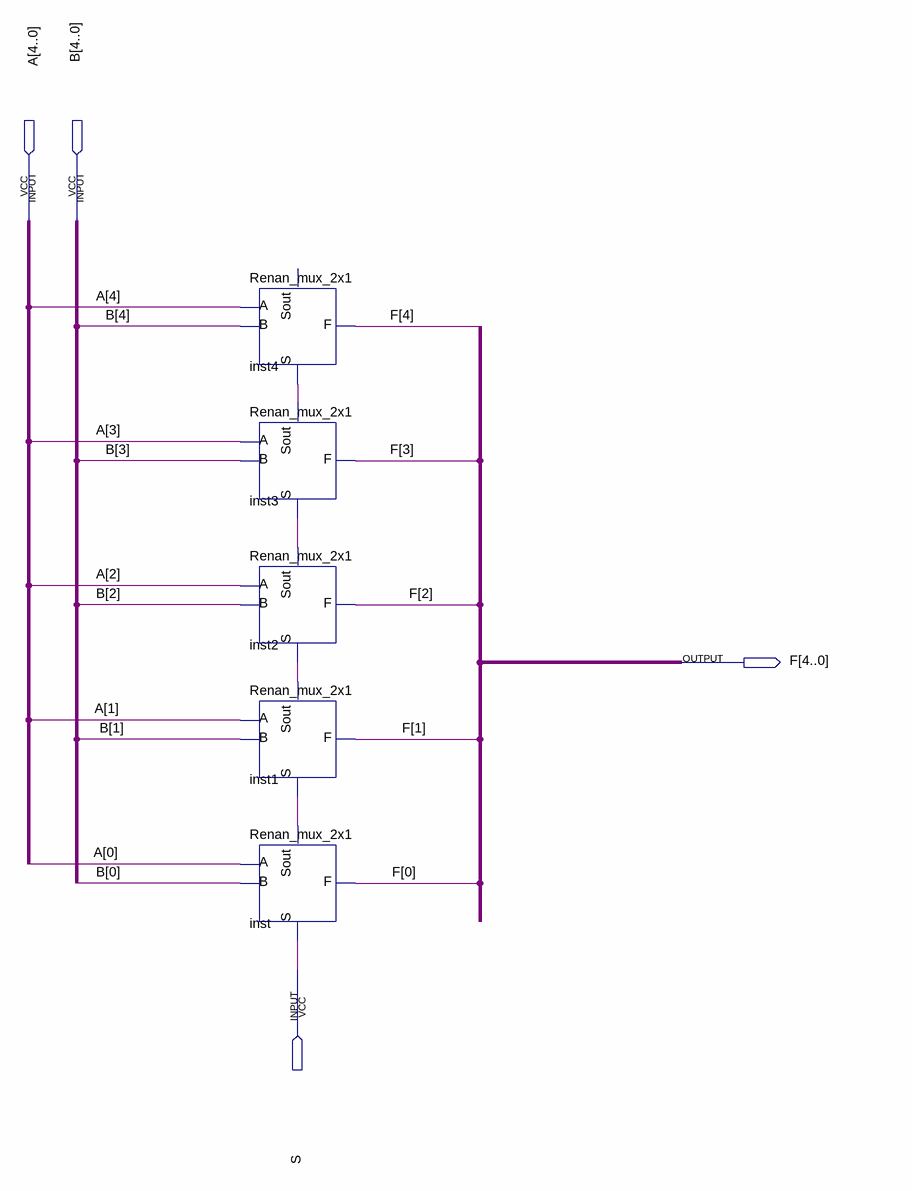
[diagram p0: schematic sheet]
// Quartus schematic mhrs_renan_2x1_total.bdf as structural Verilog: 5 symbols, 4 pins
module mhrs_renan_2x1_total (
  input  [4:0] A,
  input  [4:0] B,
  input  S,
  output [4:0] F
);

  wire inst1_sout, inst2_sout, inst3_sout, inst_sout;

  Renan_mux_2x1 inst4 (.A(A[4]), .B(B[4]), .S(inst3_sout), .F(F[4]));  // open: Sout
  Renan_mux_2x1 inst3 (.A(A[3]), .B(B[3]), .S(inst2_sout), .Sout(inst3_sout), .F(F[3]));
  Renan_mux_2x1 inst2 (.A(A[2]), .B(B[2]), .S(inst1_sout), .Sout(inst2_sout), .F(F[2]));
  Renan_mux_2x1 inst1 (.A(A[1]), .B(B[1]), .S(inst_sout), .Sout(inst1_sout), .F(F[1]));
  Renan_mux_2x1 inst (.A(A[0]), .B(B[0]), .S(S), .Sout(inst_sout), .F(F[0]));
endmodule
